# Altium schematic sheet ClimaSens-Touch.SchDoc
size A4
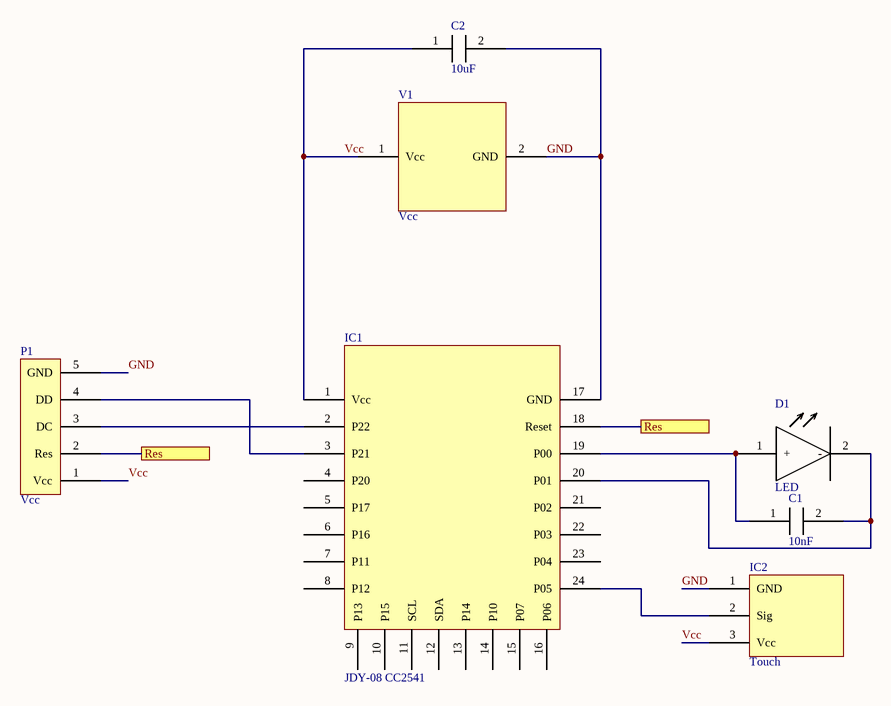
[diagram p0: ClimaSens-Touch.SchDoc]

## Parts
C1  10nF  [0805]
C2  10uF  [0805]
D1  LED  [LED 3mm]
IC1  JDY-08 CC2541  [JDY-08 CC2541]
IC2  Touch  [Touch]
P1  Vcc  [ProgramPort]
V1  Vcc  [Battery-Clip]

## Ports
Res

## Nets
GND: C2.2 IC1.17(GND) IC2.1(GND) P1.5(GND) V1.2(GND)
Res: IC1.18(Reset) P1.2(Res) ; port Res
Vcc: C2.1 IC1.1(Vcc) IC2.3(Vcc) P1.1(Vcc) V1.1(Vcc)
NetC1_1: C1.1 D1.1(+) IC1.19(P00)
NetC1_2: C1.2 D1.2(-) IC1.20(P01)
NetIC1_2: IC1.2(P22) P1.3(DC)
NetIC1_3: IC1.3(P21) P1.4(DD)
NetIC1_24: IC1.24(P05) IC2.2(Sig)

Not connected (* = marked no-connect by the designer): IC1 4(P20) 5(P17) 6(P16) 7(P11) 8(P12) 9(P13) 10(P15) 11(SCL) 12(SDA) 13(P14) 14(P10) 15(P07) 16(P06) 21(P02) 22(P03) 23(P04)

## Library data of the parts
C1 C2 = Capacitator
P1 = ProgramPort
V1 = Battery Clip